# Altium schematic sheet RV1126B EMMC.SchDoc: EMMC OF CPU
size A4; DrawnBy: ThanhQuoc; Revision: V01; SheetNumber: 9; SheetTotal: 21; Project: RV1126 CAMERA BOARD DESIGN
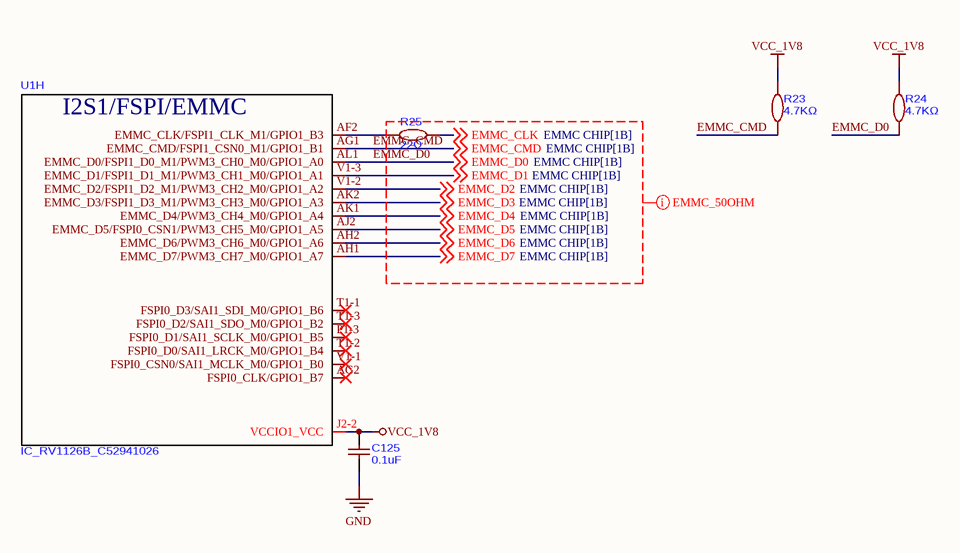
[diagram p0: RV1126B EMMC.SchDoc]

## Parts
C125  0.1uF  [C0201]
R23  4.7KΩ  [R0201]
R24  4.7KΩ  [R0201]
R25  22Ω  [R0201]
U1  IC_RV1126B_C52941026  [CCSP-491_L14.0-W14.0-TL_RV1126B]  (part H of 18)

## Nets
GND: C125.1
VCC_1V8: C125.2 R23.2 R24.2 U1.J2-2(VCCIO1_VCC)
EMMC_CLK: R25.2 ; off-sheet EMMC_CLK
EMMC_CMD: R23.1 U1.AG1(EMMC_CMD/FSPI1_CSN0_M1/GPIO1_B1) ; off-sheet EMMC_CMD
EMMC_D0: R24.1 U1.AL1(EMMC_D0/FSPI1_D0_M1/PWM3_CH0_M0/GPIO1_A0) ; off-sheet EMMC_D0
EMMC_D1: U1.V1-3(EMMC_D1/FSPI1_D1_M1/PWM3_CH1_M0/GPIO1_A1) ; off-sheet EMMC_D1
EMMC_D2: U1.V1-2(EMMC_D2/FSPI1_D2_M1/PWM3_CH2_M0/GPIO1_A2) ; off-sheet EMMC_D2
EMMC_D3: U1.AK2(EMMC_D3/FSPI1_D3_M1/PWM3_CH3_M0/GPIO1_A3) ; off-sheet EMMC_D3
EMMC_D4: U1.AK1(EMMC_D4/PWM3_CH4_M0/GPIO1_A4) ; off-sheet EMMC_D4
EMMC_D5: U1.AJ2(EMMC_D5/FSPI0_CSN1/PWM3_CH5_M0/GPIO1_A5) ; off-sheet EMMC_D5
EMMC_D6: U1.AH2(EMMC_D6/PWM3_CH6_M0/GPIO1_A6) ; off-sheet EMMC_D6
EMMC_D7: U1.AH1(EMMC_D7/PWM3_CH7_M0/GPIO1_A7) ; off-sheet EMMC_D7
NetR25_1: R25.1 U1.AF2(EMMC_CLK/FSPI1_CLK_M1/GPIO1_B3)

Not connected (* = marked no-connect by the designer): U1 AG2(FSPI0_CLK/GPIO1_B7)* P1-3(FSPI0_D1/SAI1_SCLK_M0/GPIO1_B5)* T1-1(FSPI0_D3/SAI1_SDI_M0/GPIO1_B6)* T1-2(FSPI0_D0/SAI1_LRCK_M0/GPIO1_B4)* T1-3(FSPI0_D2/SAI1_SDO_M0/GPIO1_B2)* V1-1(FSPI0_CSN0/SAI1_MCLK_M0/GPIO1_B0)*

## Layout directives
net class EMMC_50OHM: EMMC_CLK, EMMC_CMD, EMMC_D0, EMMC_D1, EMMC_D2, EMMC_D3, EMMC_D4, EMMC_D5, EMMC_D6, EMMC_D7

## Notes on the sheet
- Title:
- Drawn By:
- Page Contents:
- Checked By:
- Size:
- Date:
- File:
- License:
- Email:
- A4
- nguyenthanhquoc0206@gmail.com
- Number:
- Time:
- Revision:
- Sheet
- Website:
- of
- https://www.facebook.com/ntq.687
- (in symbol IC_RV1126B_C52941026, part H) I2S1/FSPI/EMMC

## Library data of the parts
C125 = CAP_100nF-6.3V-10%-0201_1: 0.1uF ±10% 6.3V Ceramic Capacitor X5R 0201
R23 R24 = RES_4.7K-50mW-1%-0201: RES 4.7kΩ ±1% 50mW 0201; ComponentLink1Description: LCSC; ComponentLink1URL: https://www.lcsc.com/product-detail/C295718.html?s_z=n_q_t_120%2520OHM&spm=wm.fly.bg.5.xh___wm.ssy.tc.1.tz&lcsc_vid=EwRWBFZSQVIPVFdUTlJfVldeFFRYUFQAElRYBFRRE1MxVlNeRFZeU1BfTlBYVzsOAxUeFF5JWBYZEEoKFBINSQcJGk4eFQsCAgIaSgADAwAHC0slRVhcV1ZTT08GEwkK
R25 = RES_22-50mW-1%-0201: RES 22Ω ±1% 50mW 0201; ComponentLink1Description: LCSC; ComponentLink1URL: https://www.lcsc.com/product-detail/C295718.html?s_z=n_q_t_120%2520OHM&spm=wm.fly.bg.5.xh___wm.ssy.tc.1.tz&lcsc_vid=EwRWBFZSQVIPVFdUTlJfVldeFFRYUFQAElRYBFRRE1MxVlNeRFZeU1BfTlBYVzsOAxUeFF5JWBYZEEoKFBINSQcJGk4eFQsCAgIaSgADAwAHC0slRVhcV1ZTT08GEwkK